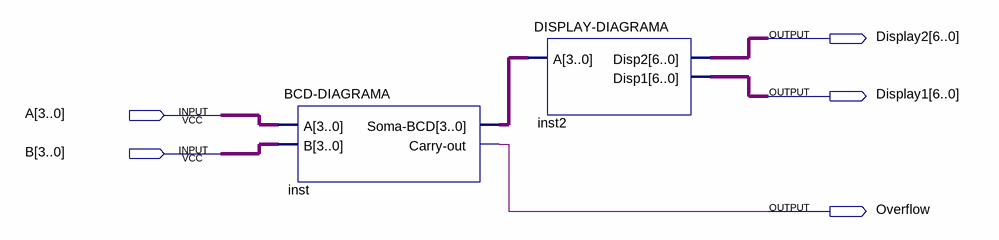
[diagram p0: schematic sheet]
// Quartus schematic BCD-COMPLETO-DIAGRAMA.bdf as structural Verilog: 2 symbols, 5 pins
module \BCD-COMPLETO-DIAGRAMA  (
  input  [3:0] A,
  input  [3:0] B,
  output [6:0] Display2,
  output [6:0] Display1,
  output Overflow
);

  wire [3:0] inst_soma_bcd;

  \BCD-DIAGRAMA  inst (.A(A), .B(B), .\Soma-BCD (inst_soma_bcd), .\Carry-out (Overflow));
  \DISPLAY-DIAGRAMA  inst2 (.A(inst_soma_bcd), .Disp2(Display2), .Disp1(Display1));
endmodule
